# EAGLE design programmer-shield (EAGLE 7.2.0)
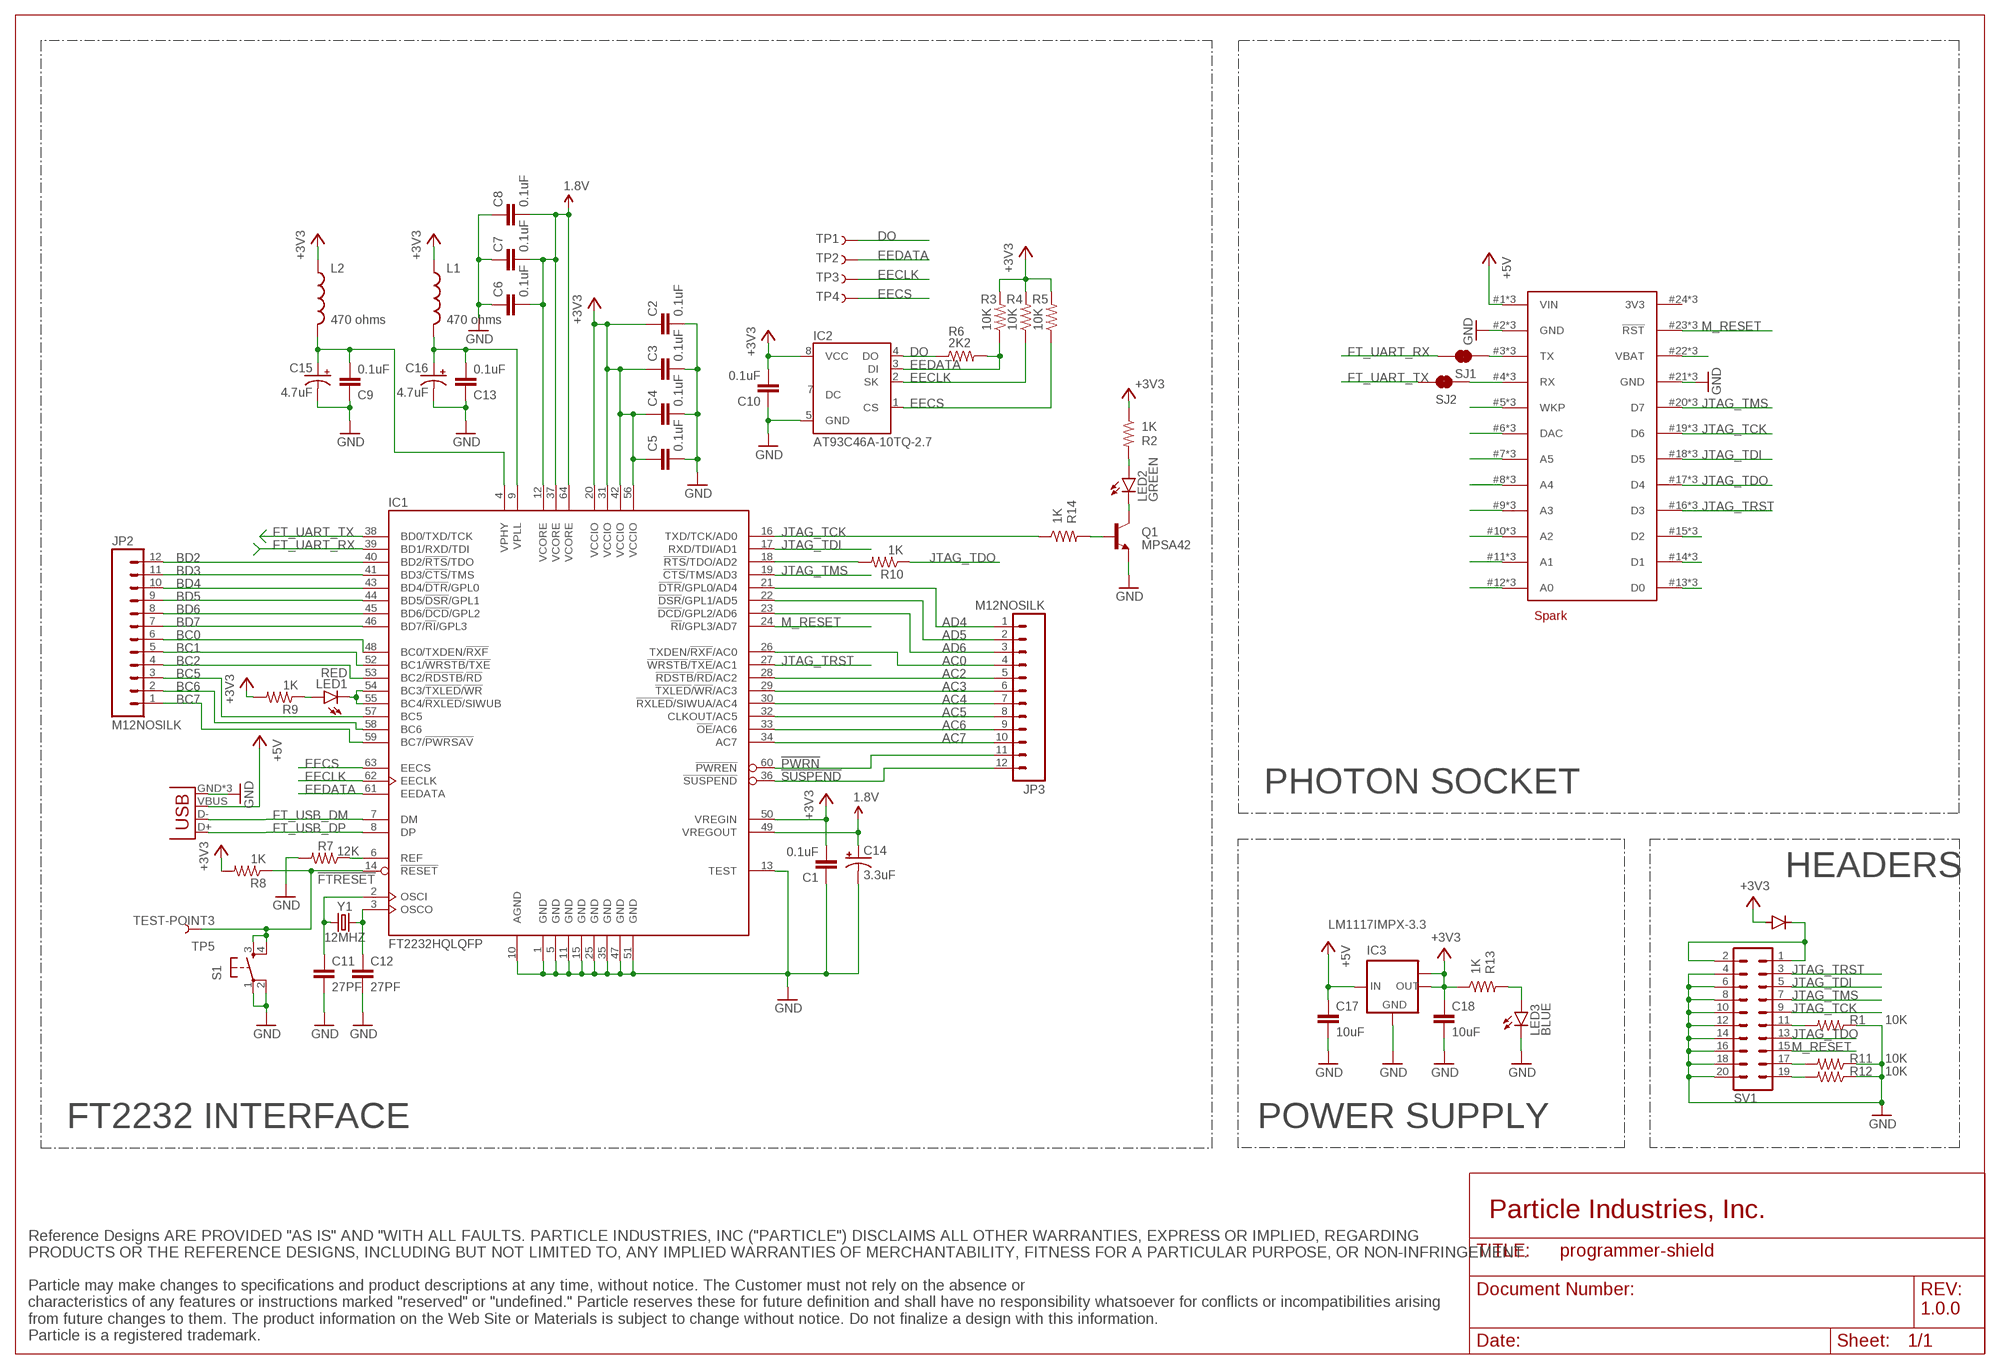
[diagram p0: schematic, sheet 1]

## Parts
C1  0.1uF  0.1UF-25V-5%(0603)  [0603-CAP]
C2  0.1uF  0.1UF-25V-5%(0603)  [0603-CAP]
C3  0.1uF  0.1UF-25V-5%(0603)  [0603-CAP]
C4  0.1uF  0.1UF-25V-5%(0603)  [0603-CAP]
C5  0.1uF  0.1UF-25V-5%(0603)  [0603-CAP]
C6  0.1uF  0.1UF-25V-5%(0603)  [0603-CAP]
C7  0.1uF  0.1UF-25V-5%(0603)  [0603-CAP]
C8  0.1uF  0.1UF-25V-5%(0603)  [0603-CAP]
C9  0.1uF  0.1UF-25V-5%(0603)  [0603-CAP]
C10  0.1uF  0.1UF-25V-5%(0603)  [0603-CAP]
C11  27PF  CAP0603-CAP  [0603-CAP]
C12  27PF  CAP0603-CAP  [0603-CAP]
C13  0.1uF  0.1UF-25V-5%(0603)  [0603-CAP]
C14  3.3uF  CAP_POL1206  [EIA3216]
C15  4.7uF  CAP_POL1206  [EIA3216]
C16  4.7uF  CAP_POL1206  [EIA3216]
C17  10uF  CAP0603-CAP  [0603-CAP]
C18  10uF  CAP0603-CAP  [0603-CAP]
D1  DIODE  [DIODE-DO-220AA(SMP)]
IC1  FT2232HQLQFP  [TQFP64-10X10]
IC2  AT93C46A-10TQ-2.7  [TSSOP8]
IC3  LM1117IMPX-3.3  [SOT223]
JP1  USBUSB-MICROB-SLOT-HOLE  [USB-MICROB-SLOT-HOLE]
JP2  M12NOSILK  [1X12-SMALL-PADS-NO-SILK]
JP3  M12NOSILK  [1X12-SMALL-PADS-NO-SILK]
L1  470 ohms  INDUCTOR0603  [0603]
L2  470 ohms  INDUCTOR0603  [0603]
LED1  RED  LED0603  [LED-0603]
LED2  GREEN  LED0603  [LED-0603]
LED3  BLUE  LED0603  [LED-0603]
Q1  MPSA42  TRANSISTOR_NPNMPSA42  [SOT23]
R1  10K  RESISTOR0603  [0603-RES]
R2  1K  RESISTOR0603  [0603-RES]
R3  10K  RESISTOR0603  [0603-RES]
R4  10K  RESISTOR0603  [0603-RES]
R5  10K  RESISTOR0603  [0603-RES]
R6  2K2  RESISTOR0603  [0603-RES]
R7  12K  RESISTOR0603  [0603-RES]
R8  1K  RESISTOR0603  [0603-RES]
R9  1K  RESISTOR0603  [0603-RES]
R10  1K  RESISTOR0603  [0603-RES]
R11  10K  RESISTOR0603  [0603-RES]
R12  10K  RESISTOR0603  [0603-RES]
R13  1K  RESISTOR0603  [0603-RES]
R14  1K  RESISTOR0603  [0603-RES]
S1  TAC_SWITCHSMD  [TACTILE_SWITCH_SMD]
SJ1  JUMPER-PAD-2-NC_BY_TRACE  [PAD-JUMPER-2-NC_BY_TRACE_YES_SILK]
SJ2  JUMPER-PAD-2-NC_BY_TRACE  [PAD-JUMPER-2-NC_BY_TRACE_YES_SILK]
SV1  ML20  [ML20]
TP1  TEST-POINT3  [PAD.03X.03]
TP2  TEST-POINT3  [PAD.03X.03]
TP3  TEST-POINT3  [PAD.03X.03]
TP4  TEST-POINT3  [PAD.03X.03]
TP5  TEST-POINT3  [PAD.03X.03]
U$1  SPARK_LOGO  [SPARK_LOGO_TSTOP]
U$3  SPARK_CORE  [SPARK_CORE_STACKABLE]
Y1  12MHZ  CRYSTALTXC-7A  [CRYSTAL-TXC-7A]

## Nets
1.8V: C6.2 C7.2 C8.2 C14.A(+) IC1.12(VCORE) IC1.37(VCORE) IC1.49(VREGOUT) IC1.64(VCORE)
!FTRESET: IC1.14(!RESET) R8.1 S1.3 S1.4 TP5.P$1
!PWRN: IC1.60(!PWREN) JP3.11
!SUSPEND: IC1.36(!SUSPEND) JP3.12
+3V3: C1.2 C2.1 C3.1 C4.1 C5.1 C10.2 C18.1 D1.ANODE IC1.20(VCCIO) IC1.31(VCCIO) IC1.42(VCCIO) IC1.50(VREGIN) IC1.56(VCCIO) IC2.8(VCC) IC3.2(OUT) IC3.TAB(OUT1) L1.1 L2.1 R2.1 R3.2 R4.2 R5.2 R8.2 R9.2 R13.1
+5V: C17.1 IC3.3(IN) JP1.VBUS U$3.1(VIN) U$3.#1(VIN) U$3.@1(VIN)
AC0: IC1.26(TXDEN/!RXF!/AC0) JP3.4
AC2: IC1.28(!RDSTB!/!RD!/AC2) JP3.5
AC3: IC1.29(!TXLED!/!WR!/AC3) JP3.6
AC4: IC1.30(!RXLED!/SIWUA/AC4) JP3.7
AC5: IC1.32(CLKOUT/AC5) JP3.8
AC6: IC1.33(!OE!/AC6) JP3.9
AC7: IC1.34(AC7) JP3.10
AD4: IC1.21(!DTR!/GPL0/AD4) JP3.1
AD5: IC1.22(!DSR!/GPL1/AD5) JP3.2
AD6: IC1.23(!DCD!/GPL2/AD6) JP3.3
BC0: IC1.48(BC0/TXDEN/!RXF) JP2.6
BC1: IC1.52(BC1/!WRSTB!/!TXE) JP2.5
BC2: IC1.53(BC2/!RDSTB!/!RD) JP2.4
BC5: IC1.57(BC5) JP2.3
BC6: IC1.58(BC6) JP2.2
BC7: IC1.59(BC7/!PWRSAV) JP2.1
BD2: IC1.40(BD2/!RTS!/TDO) JP2.12
BD3: IC1.41(BD3/!CTS!/TMS) JP2.11
BD4: IC1.43(BD4/!DTR!/GPL0) JP2.10
BD5: IC1.44(BD5/!DSR!/GPL1) JP2.9
BD6: IC1.45(BD6/!DCD!/GPL2) JP2.8
BD7: IC1.46(BD7/!RI!/GPL3) JP2.7
DO: IC2.4(DO) R6.1 TP1.P$1
EECLK: IC1.62(EECLK) IC2.2(SK) R4.1 TP3.P$1
EECS: IC1.63(EECS) IC2.1(CS) R5.1 TP4.P$1
EEDATA: IC1.61(EEDATA) IC2.3(DI) R3.1 R6.2 TP2.P$1
FT_UART_RX: IC1.39(BD1/RXD/TDI) SJ1.2
FT_UART_TX: IC1.38(BD0/TXD/TCK) SJ2.2
FT_USB_DM: IC1.7(DM) JP1.D-
FT_USB_DP: IC1.8(DP) JP1.D+
GND: C1.1 C2.2 C3.2 C4.2 C5.2 C6.1 C7.1 C8.1 C9.1 C10.1 C11.2 C12.2 C13.1 C14.C(-) C15.C(-) C16.C(-) C17.2 C18.2 IC1.1(GND) IC1.5(GND) IC1.10(AGND) IC1.11(GND) IC1.13(TEST) IC1.15(GND) IC1.25(GND) IC1.35(GND) IC1.47(GND) IC1.51(GND) IC2.5(GND) IC3.1(GND) JP1.GND JP1.MT1(GND) JP1.MT2(GND) LED3.C Q1.2(E) R1.1 R7.2 R11.1 R12.1 S1.1 S1.2 SV1.4 SV1.6 SV1.8 SV1.10 SV1.12 SV1.14 SV1.16 SV1.18 SV1.20 U$3.2(GND) U$3.21(GND) U$3.#2(GND) U$3.#21(GND) U$3.@2(GND) U$3.@21(GND)
JTAG_TCK: IC1.16(TXD/TCK/AD0) R14.1 SV1.9 U$3.19(D6) U$3.#19(D6) U$3.@19(D6)
JTAG_TDI: IC1.17(RXD/TDI/AD1) SV1.5 U$3.18(D5) U$3.#18(D5) U$3.@18(D5)
JTAG_TDO: R10.1 SV1.13 U$3.17(D4) U$3.#17(D4) U$3.@17(D4)
JTAG_TMS: IC1.19(!CTS!/TMS/AD3) SV1.7 U$3.20(D7) U$3.#20(D7) U$3.@20(D7)
JTAG_TRST: IC1.27(!WRSTB!/!TXE!/AC1) SV1.3 U$3.16(D3) U$3.#16(D3) U$3.@16(D3)
M_RESET: IC1.24(!RI!/GPL3/AD7) SV1.15 U$3.23(!RST) U$3.#23(!RST) U$3.@23(!RST)
N$1: IC1.6(REF) R7.1
N$2: C13.2 C16.A(+) IC1.9(VPLL) L1.2
N$3: SJ1.1 U$3.3(TX) U$3.#3(TX) U$3.@3(TX)
N$4: C12.1 IC1.3(OSCO) Y1.P$2
N$5: C11.1 IC1.2(OSCI) Y1.P$1
N$6: C9.2 C15.A(+) IC1.4(VPHY) L2.2
N$7: IC1.54(BC3/!TXLED!/!WR) IC1.55(BC4/!RXLED!/SIWUB) LED1.C
N$8: LED1.A R9.1
N$9: Q1.1(B) R14.2
N$10: U$3.22(VBAT) U$3.#22(VBAT) U$3.@22(VBAT)
N$11: U$3.15(D2) U$3.#15(D2) U$3.@15(D2)
N$12: LED3.A R13.2
N$13: U$3.14(D1) U$3.#14(D1) U$3.@14(D1)
N$14: U$3.13(D0) U$3.#13(D0) U$3.@13(D0)
N$15: IC1.18(!RTS!/TDO/AD2) R10.2
N$16: U$3.5(WKP) U$3.#5(WKP) U$3.@5(WKP)
N$17: U$3.6(DAC) U$3.#6(DAC) U$3.@6(DAC)
N$18: U$3.7(A5) U$3.#7(A5) U$3.@7(A5)
N$19: U$3.8(A4) U$3.#8(A4) U$3.@8(A4)
N$20: U$3.9(A3) U$3.#9(A3) U$3.@9(A3)
N$21: U$3.10(A2) U$3.#10(A2) U$3.@10(A2)
N$22: U$3.11(A1) U$3.#11(A1) U$3.@11(A1)
N$23: SJ2.1 U$3.4(RX) U$3.#4(RX) U$3.@4(RX)
N$24: U$3.12(A0) U$3.#12(A0) U$3.@12(A0)
N$25: D1.CATHODE SV1.1 SV1.2
N$44: LED2.C Q1.3(C)
N$45: LED2.A R2.2
N$50: R1.2 SV1.11
N$53: R11.2 SV1.17
N$54: R12.2 SV1.19
Unconnected: IC2.6(NC) IC2.7(DC)

## Notes on the sheet
- PHOTON SOCKET
- HEADERS
- FT2232 INTERFACE | POWER SUPPLY
- Particle Industries, Inc.
- 1.0.0
- Reference Designs ARE PROVIDED "AS IS" AND "WITH ALL FAULTS. PARTICLE INDUSTRIES, INC ("PARTICLE") DISCLAIMS ALL OTHER WARRANTIES, EXPRESS OR IMPLIED, REGARDING 
  PRODUCTS OR THE REFERENCE DESIGNS, INCLUDING BUT NOT LIMITED TO, ANY IMPLIED WARRANTIES OF MERCHANTABILITY, FITNESS FOR A PARTICULAR PURPOSE, OR NON-INFRINGEMENT.
  
  Particle may make changes to specifications and product descriptions at any time, without notice. The Customer must not rely on the absence or 
  characteristics of any features or instructions marked "reserved" or "undefined." Particle reserves these for future definition and shall have no responsibility whatsoever for conflicts or incompatibilities arising 
  from future changes to them. The product information on the Web Site or Materials is subject to change without notice. Do not finalize a design with this information. 
  Particle is a registered trademark.

## Power pins joined to a net without a drawn wire
3V3: U$3.24(3V3) U$3.#24(3V3) U$3.@24(3V3)

## Library data of the parts
C1-C10 C13 = SparkFun-Capacitors:0.1UF-25V-5%(0603): CAP-08604; PROD_ID: CAP-08604
C11 C12 C17 C18 = SparkFun-Capacitors:CAP: Capacitor Standard 0603 ceramic capacitor, and 0.1" leaded capacitor.
C14-C16 = SparkFun-Capacitors:CAP_POL: Capacitor Polarized These are standard SMD and PTH capacitors. Normally 10uF, 47uF, and 100uF in electrolytic and tantalum varieties. Always verify the external diameter of the through hole cap, it varies with capacity, voltage, and manufacturer. The EIA devices should be standard.
D1 = Spark:DIODE
IC1 = jt-ftdi:FT2232HQ: FTDI FT2232 dual RS232
IC2 = atmel:AT93C46A-10?Q-2.7: Three-wire Automotive Temperature Serial EEPROM 1K (64 x 16) Source: http://www.atmel.com/dyn/resources/prod_documents/doc5089.pdf; OC_FARNELL: unknown; OC_NEWARK: unknown
IC3 = lm1117:LM1117IMPX-*
JP1 = Spark:USB
JP2 JP3 = Spark:M12: Header 12 Standard 12-pin 0.1" header. Use with straight break away headers (SKU : PRT-00116), right angle break away headers (PRT-00553), swiss pins (PRT-00743), machine pins (PRT-00117), and female headers (PRT-00115).
L1 L2 = SparkFun-Passives:INDUCTOR: Inductors Basic Inductor/Choke - 0603 and 1206. Footprints are not proven and vary greatly between part numbers. SRN6045- 33uH, 20% 1.4A SDR0403-560KL - 56uH, 10%, 500mA RMS/740mA peak
LED1-LED3 = SparkFun-LED:LED: LEDs Standard schematic elements and footprints for 5mm, 3mm, 1206, and 0603 sized LEDs. 5mm - Spark Fun Electronics SKU : COM-00529 (and others)
Q1 = SparkFun-DiscreteSemi:TRANSISTOR_NPN: Generic NPN BJT MMBT2222A - TRANS-08049 (SOT-23, 1A 40V) MPSA42 - TRANS-09116 (SOT-23, 500mA 300V) MMBT5088LT1G - TRANS-11160 (SOT-23, 50 mA 30V) BC547 - COM-08928 <http://www.sparkfun.com/products/8928> (TO-92 45V 100mA) (1.Collector 2.Base 3.Emitter) 2N3904 - COM-00521 <http://www.sparkfun.com/products/521> (TO-92 40V 200mA) (1.Emitter 2.Base 3.Collector) P2N2222A - COM-12852 <http://www.sparkfun.com/products/12852> (TO-92 40V 600mA) (1.Collector 2.Base 3.Emitter); PROD_ID: TRANS-09116
R1-R14 = SparkFun-Resistors:RESISTOR: Resistor Basic schematic elements and footprints for 0603, 1206, and PTH resistors.
S1 = Spark:TAC_SWITCH: SMD Tactiile Switch
SJ1 SJ2 = SparkFun-Passives:JUMPER-PAD-2-NC_BY_TRACE
SV1 = Spark:ML20: HARTING; OC_FARNELL: unknown; OC_NEWARK: unknown
TP1-TP5 = SparkFun-Passives:TEST-POINT: Bare copper test points for troubleshooting or ICT
U$1 = Spark:SPARK_LOGO
U$3 = Spark:SPARK_CORE
Y1 = SparkFun-FreqCtrl:CRYSTAL: Various standard crystals. Proven footprints. Spark Fun Electronics SKU : COM-00534

## Board
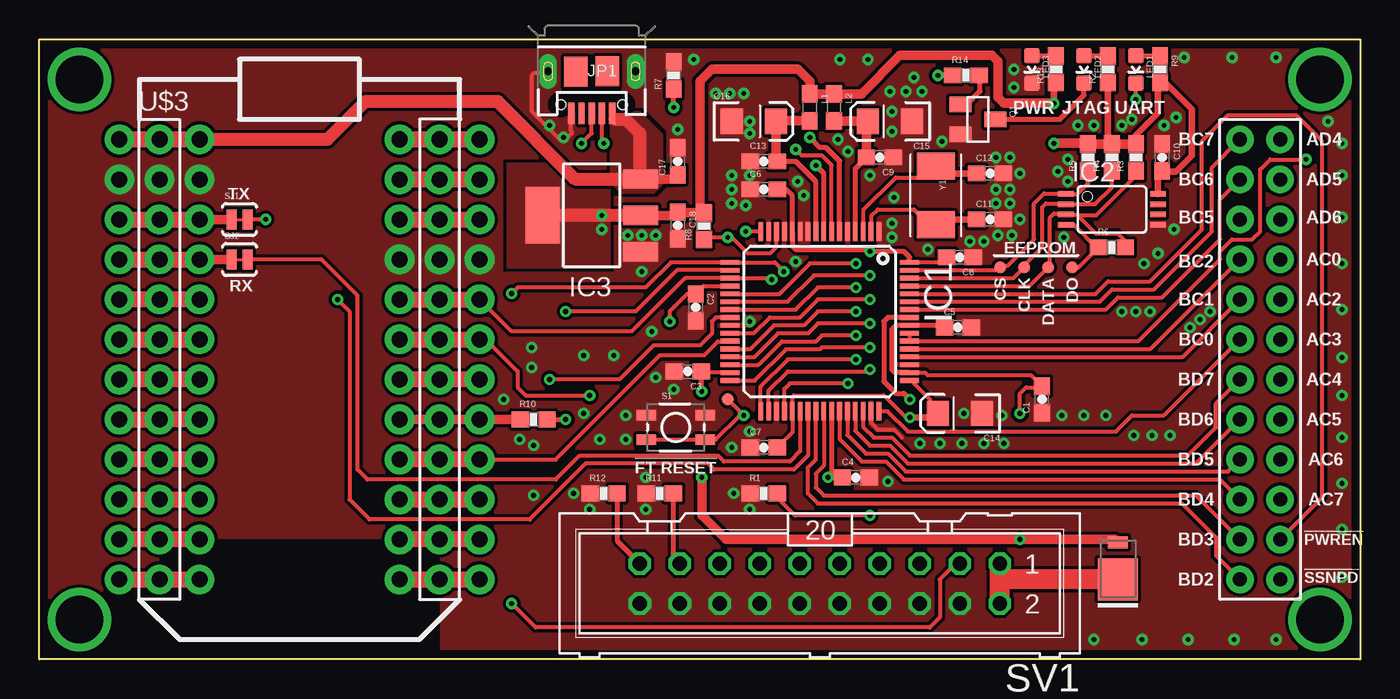
[diagram p1: board, top side]
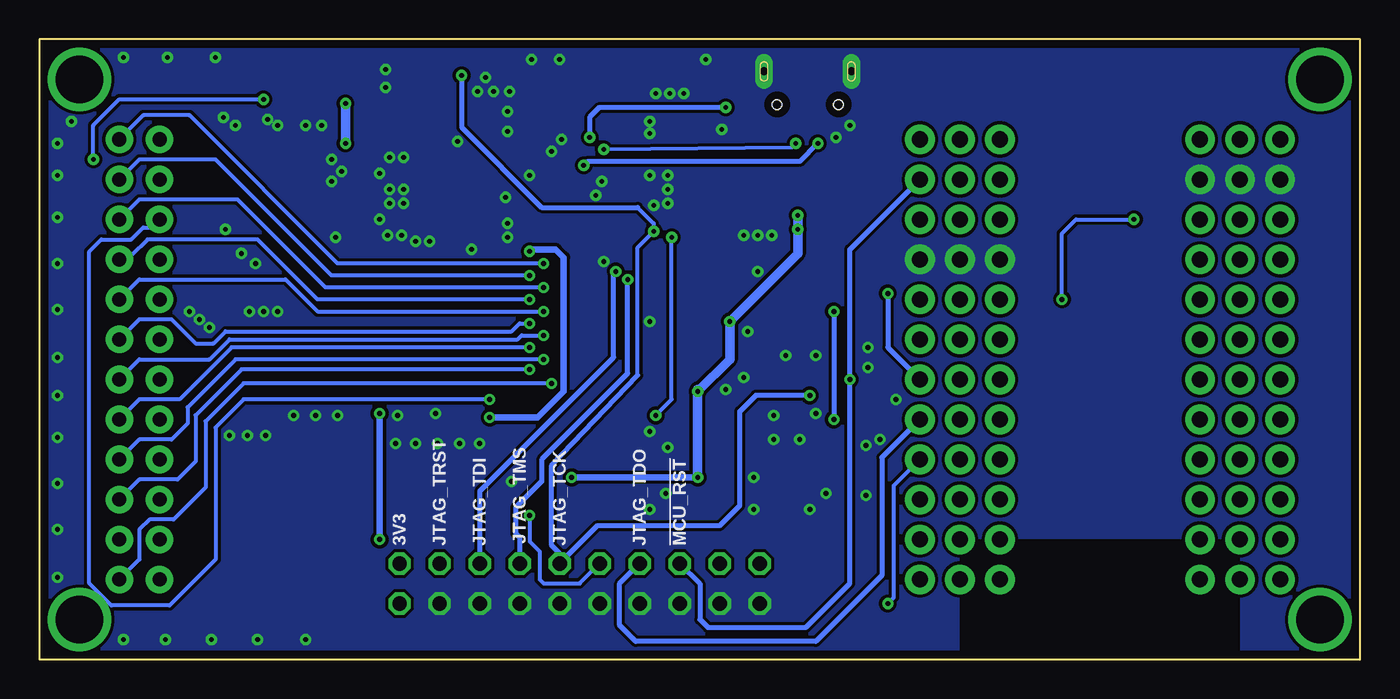
[diagram p2: board, bottom side, seen from below]

Size 83.82 x 39.37 mm. Coordinates in mm from the lower left corner, seen from the top.
Outline: 0,39.37 83.82,39.37 83.82,0 0,0 0,39.37
Copper layers (1*16): Top 0.035mm / dielectric 1.5mm / Bottom 0.035mm
Design rules "default *": minimum track width 10mil, minimum drill 24mil, track to track 8mil, track to pad 8mil, pad to pad 8mil, via to via 8mil, smd to smd 8mil, copper to edge 20mil, drill to drill 8mil, minimum pad ring 10mil, minimum via ring 8mil, stop-mask expansion 4mil, vias tented up to drill 12mil, thermal gap 10mil
tRestrict: area 7.6,0 to 25.4,7.6
bRestrict: area 7.6,0 to 25.4,7.6

### Footprints (pad centres in the part's own frame; a part is rotated, then mirrored left to right if it is on the bottom)
0603-CAP = smd 1.1 x 1: 1 -0.85,0; 2 0.85,0
EIA3216 = smd 1.4 x 1.6: A 1.4,0; C -1.4,0
DIODE-DO-220AA(SMP) = smd 0.762 x 1.27: ANODE 2.349,0 | smd 2.667 x 2.54: CATHODE 0,0
TQFP64-10X10 = smd 1.2 x 0.3: 1 -5.7,3.75; 2 -5.7,3.25; 3 -5.7,2.75; 4 -5.7,2.25; 5 -5.7,1.75; 6 -5.7,1.25; 7 -5.7,0.75; 8 -5.7,0.25; 9 -5.7,-0.25; 10 -5.7,-0.75; 11 -5.7,-1.25; 12 -5.7,-1.75; 13 -5.7,-2.25; 14 -5.7,-2.75; 15 -5.7,-3.25; 16 -5.7,-3.75; 33 5.7,-3.75; 34 5.7,-3.25; 35 5.7,-2.75; 36 5.7,-2.25; 37 5.7,-1.75; 38 5.7,-1.25; 39 5.7,-0.75; 40 5.7,-0.25; 41 5.7,0.25; 42 5.7,0.75; 43 5.7,1.25; 44 5.7,1.75; 45 5.7,2.25; 46 5.7,2.75; 47 5.7,3.25; 48 5.7,3.75 | smd 0.3 x 1.2: 17 -3.75,-5.7; 18 -3.25,-5.7; 19 -2.75,-5.7; 20 -2.25,-5.7; 21 -1.75,-5.7; 22 -1.25,-5.7; 23 -0.75,-5.7; 24 -0.25,-5.7; 25 0.25,-5.7; 26 0.75,-5.7; 27 1.25,-5.7; 28 1.75,-5.7; 29 2.25,-5.7; 30 2.75,-5.7; 31 3.25,-5.7; 32 3.75,-5.7; 49 3.75,5.7; 50 3.25,5.7; 51 2.75,5.7; 52 2.25,5.7; 53 1.75,5.7; 54 1.25,5.7; 55 0.75,5.7; 56 0.25,5.7; 57 -0.25,5.7; 58 -0.75,5.7; 59 -1.25,5.7; 60 -1.75,5.7; 61 -2.25,5.7; 62 -2.75,5.7; 63 -3.25,5.7; 64 -3.75,5.7
TSSOP8 = smd 0.35 x 1: 1 -0.975,-2.925; 2 -0.325,-2.925; 3 0.325,-2.925; 4 0.975,-2.925; 5 0.975,2.925; 6 0.325,2.925; 7 -0.325,2.925; 8 -0.975,2.925
SOT223 = smd 1.219 x 2.235: 1 -2.311,-3.099; 2 0,-3.099; 3 2.311,-3.099 | smd 3.6 x 2.2: TAB 0,3.099
USB-MICROB-SLOT-HOLE = smd 0.4 x 1.35: D+ 0,2.675; D- -0.65,2.675; GND 1.3,2.675; ID 0.65,2.675; VBUS -1.3,2.675 | drill 0.5 pad 1.1 long: MT1 -2.775,0; MT2 2.775,0 | smd 1.5 x 1.9: P$1 -1,0; P$2 1,0.01 | hole 0.6: -1.95,2.1; 1.95,2.1
1X12-SMALL-PADS-NO-SILK = drill 0.889 pad 1.753: 1 -13.97,0; 2 -11.43,0; 3 -8.89,0; 4 -6.35,0; 5 -3.81,0; 6 -1.27,0; 7 1.27,0; 8 3.81,0; 9 6.35,0; 10 8.89,0; 11 11.43,0; 12 13.97,0
0603 = smd 1.1 x 1: 1 -0.85,0; 2 0.85,0
LED-0603 = smd 1 x 1: A 0,-0.877; C 0,0.877
SOT23 = smd 1 x 1.4: 1 -0.95,-1.1; 2 0.95,-1.1; 3 0,1.1
0603-RES = smd 1.1 x 1: 1 -0.85,0; 2 0.85,0
TACTILE_SWITCH_SMD = smd 1.25 x 0.65: 1 -1.875,0.775; 2 1.875,0.775; 3 -1.875,-0.775; 4 1.875,-0.775
PAD-JUMPER-2-NC_BY_TRACE_YES_SILK = smd 0.635 x 1.27: 1 -0.508,0; 2 0.508,0
ML20 = drill 0.914 octagon: 1 -11.43,-1.27; 2 -11.43,1.27; 3 -8.89,-1.27; 4 -8.89,1.27; 5 -6.35,-1.27; 6 -6.35,1.27; 7 -3.81,-1.27; 8 -3.81,1.27; 9 -1.27,-1.27; 10 -1.27,1.27; 11 1.27,-1.27; 12 1.27,1.27; 13 3.81,-1.27; 14 3.81,1.27; 15 6.35,-1.27; 16 6.35,1.27; 17 8.89,-1.27; 18 8.89,1.27; 19 11.43,-1.27; 20 11.43,1.27
PAD.03X.03 = smd 0.762 x 0.762: P$1 0,0
SPARK_CORE_STACKABLE = drill 1.016 pad 1.88: 1 -8.89,13.97; 2 -8.89,11.43; 3 -8.89,8.89; 4 -8.89,6.35; 5 -8.89,3.81; 6 -8.89,1.27; 7 -8.89,-1.27; 8 -8.89,-3.81; 9 -8.89,-6.35; 10 -8.89,-8.89; 11 -8.89,-11.43; 12 -8.89,-13.97; 13 8.89,-13.97; 14 8.89,-11.43; 15 8.89,-8.89; 16 8.89,-6.35; 17 8.89,-3.81; 18 8.89,-1.27; 19 8.89,1.27; 20 8.89,3.81; 21 8.89,6.35; 22 8.89,8.89; 23 8.89,11.43; 24 8.89,13.97; #1 -6.35,13.97; #2 -6.35,11.43; #3 -6.35,8.89; #4 -6.35,6.35; #5 -6.35,3.81; #6 -6.35,1.27; #7 -6.35,-1.27; #8 -6.35,-3.81; #9 -6.35,-6.35; #10 -6.35,-8.89; #11 -6.35,-11.43; #12 -6.35,-13.97; #13 11.43,-13.97; #14 11.43,-11.43; #15 11.43,-8.89; #16 11.43,-6.35; #17 11.43,-3.81; #18 11.43,-1.27; #19 11.43,1.27; #20 11.43,3.81; #21 11.43,6.35; #22 11.43,8.89; #23 11.43,11.43; #24 11.43,13.97; @1 -11.43,13.97; @2 -11.43,11.43; @3 -11.43,8.89; @4 -11.43,6.35; @5 -11.43,3.81; @6 -11.43,1.27; @7 -11.43,-1.27; @8 -11.43,-3.81; @9 -11.43,-6.35; @10 -11.43,-8.89; @11 -11.43,-11.43; @12 -11.43,-13.97; @13 6.35,-13.97; @14 6.35,-11.43; @15 6.35,-8.89; @16 6.35,-6.35; @17 6.35,-3.81; @18 6.35,-1.27; @19 6.35,1.27; @20 6.35,3.81; @21 6.35,6.35; @22 6.35,8.89; @23 6.35,11.43; @24 6.35,13.97
CRYSTAL-TXC-7A = smd 1.7 x 2.4: P$1 1.85,0; P$2 -1.85,0

### Placement (x,y rotation side)
C1  63.63,16.51 90 top
C2  41.66,22.35 270 top
C3  41.15,18.29 180 top
C4  51.82,11.56 0 top
C5  58.29,21.08 0 top
C6  45.97,29.84 0 top
C7  45.97,13.46 0 top
C8  58.42,25.53 180 top
C9  53.34,31.88 180 top
C10  71.25,31.88 270 top
C11  60.33,27.94 0 top
C12  60.33,30.86 0 top
C13  45.97,31.62 0 top
C14  58.42,15.62 180 top
C15  53.98,34.16 180 top
C16  45.34,34.16 0 top
C17  40.51,31.62 90 top
C18  40.51,27.56 270 top
D1  68.45,5.08 90 top
IC1  49.53,21.46 270 top
IC2  68.07,28.57 270 top
IC3  35.05,28.19 90 top
JP1  35.05,37.34 180 top
JP2  76.2,19.05 270 top
JP3  78.74,19.05 270 top
L1  48.9,35.05 270 top
L2  50.42,35.05 270 top
LED1  69.6,37.47 180 top
LED2  66.29,37.47 180 top
LED3  62.99,37.47 180 top
Q1  59.56,34.29 270 top
R1  45.97,10.54 0 top
R2  67.82,37.47 90 top
R3  69.6,31.88 90 top
R4  68.07,31.88 90 top
R5  66.55,31.88 90 top
R6  68.07,26.16 0 top
R7  40.26,37.08 90 top
R8  42.17,27.51 90 top
R9  71.12,37.47 270 top
R10  31.37,15.24 0 top
R11  39.37,10.54 0 top
R12  35.81,10.54 0 top
R13  64.52,37.47 90 top
R14  58.8,37.08 0 top
S1  40.39,14.73 0 top
SJ1  12.7,27.94 0 top
SJ2  12.7,25.4 0 top
SV1  49.53,4.83 180 top
TP1  65.53,24.89 0 top
TP2  64.01,24.89 0 top
TP3  62.48,24.89 0 top
TP4  60.96,24.89 0 top
TP5  43.69,16.51 0 top
U$1  16.51,19.05 270 top
U$2  [SPARK_LOGO2]  1.14,11.05 0 top
U$3  16.51,19.05 0 top
Y1  56.9,29.46 270 top

### Tracks (layer width: path | path; a pad name or v marks a point on that pad's centre or on a via)
1.8V  (via drill 0.3, 0.3 pad 0.71)
  Top 0.254: C8.2 57.64,25.21 IC1.64 | 55.18,17.71 IC1.49 55.31,17.71 56.52,16.51 56.52,16.13 C14.A | C7.2 47.78,14.42 IC1.37 47.78,16.66 47.88,16.76 53.59,16.76 54.99,15.37 v55.24,15.37
  Top 0.305: C6.2 47.37,29.84 47.78,29.44 IC1.12 47.78,26.26 48.01,26.04 52.58,26.04 v52.7,25.91 54.86,25.91 55.23,25.54 IC1.64
  Top 0.406: v55.24,15.37 56.51,15.37 | 56.51,15.37 | 56.51,15.37 56.77,15.37 C14.A
  Bottom 0.406: v55.24,15.37 52.2,15.37 50.55,17.02 50.55,25.53 51.05,26.04 52.58,26.04 v52.7,25.91
3V3
  Top 1.016: U$3.@24 U$3.24 U$3.#24
!FTRESET  (via drill 0.3)
  Top 0.254: IC1.14 46.74,27.12 46.74,26.16 46.35,25.78 44.96,25.78 43.94,26.8 v43.69,26.8 42.31,26.8 R8.1 | S1.3 S1.4 42.91,13.96 44.45,15.49 | 44.45,15.49 v44.7,15.49 | 44.45,15.49 44.45,15.75 TP5.P$1
  Bottom 0.254: v44.7,15.49 TP5.P$1 v43.69,26.8
!PWRN
  Top 0.254: JP3.11 81.41,10.29 81.41,32.89 79.76,34.54 75.44,34.54 73.79,32.89 73.79,27.3 70.48,24 67.82,24 67.03,23.21 IC1.60
!SUSPEND  (via drill 0.3 pad 0.71)
  Top 0.254: IC1.36 47.28,17.18 47.62,17.53 v51.31,17.53
  Bottom 0.254: JP3.12 77.47,6.35 77.47,8.26 76.83,8.89 75.31,8.89 73.28,10.92 73.28,15.11 70.87,17.53 v51.31,17.53
+3V3  (via drill 0.3, 0.3 pad 0.71)
  Top 0.254: IC1.31 42.07,18.21 | IC1.20 42.17,23.71 C2.1 41.11,23.2 40.01,22.1 v40.01,21.46 | v62.23,15.62 62.23,16.89 62.61,17.27 63.54,17.27 C1.2 62.95,18.03 56.39,18.03 56.21,18.21 IC1.50
  Top 0.305: 42.07,18.21 C3.1 42,17.06 v42.04,17.02 | 50.29,15.78 IC1.42 50.28,11.8 v50.04,11.56 | IC1.50 54.3,18.21 54.1,18.41 54.1,20.95 54.36,21.21 IC1.56 57.31,21.21 C5.1
  Top 0.406: v50.04,11.56 C4.1 | R2.1 67.82,32.98 R4.2 | v64.39,35.31 64.39,36.49 R13.1 | 63.59,17.4 C1.2 | R3.2 69.6,33.27 70.99,34.67 70.99,36.49 R9.2 71.46,36.62 73.15,34.92 73.15,32 72.14,30.99 71.29,30.99 | 71.29,30.99 C10.2 | 71.29,30.99 71,30.7 IC2.8
  Top 0.61: IC3.2 40.3,28.19 C18.1 40.56,28.36 R8.2 41.91,28.63 41.91,36.7 42.67,37.47 48.13,37.47 48.9,36.7 L1.1 L2.1 52.16,35.9 54.61,38.35 60.45,38.35 60.83,37.97 60.83,35.69 61.21,35.31 v64.39,35.31 | v42.04,11.56 42.04,9.14 43.56,7.62 v62.23,7.62 68.26,7.62 D1.ANODE | R3.2 R4.2 R5.2 66.51,32.77 v64.39,32.77
  Top 0.813: IC3.2 v35.69,28.19 IC3.TAB
  Bottom 0.406: v62.23,15.62 v62.23,7.62 | v42.04,11.56 v50.04,11.56
  Bottom 0.61: v42.04,17.02 40.01,19.05 v40.01,21.46 35.69,25.78 v35.69,28.19 v35.69,27.3 | v42.04,11.56 v42.04,17.02 | v42.04,17.02 42.04,17.14 | v64.39,35.31 v64.39,32.77
  pour Top (no thermals): 36.2,24.89 29.72,24.89 29.72,31.5 36.2,31.5
+5V
  Top 0.203: JP1.VBUS 36.35,34.32 36.32,34.29
  Top 0.406: 36.32,34.29 36.58,34.29
  Top 0.61: IC3.3 40.24,30.5 C17.1
  Top 0.813: 36.58,34.29 37.21,34.29 38.1,33.4 38.1,30.56 IC3.3 34.01,30.5 29.08,35.43 20.7,35.43 18.29,33.02 U$3.#1
  Top 1.016: U$3.@1 U$3.1 U$3.#1
  pour Top (no thermals): 36.32,34.67 36.32,30.35 36.96,29.72 38.99,29.72 39.5,30.23 39.5,33.27 38.1,34.67
AC0  (via drill 0.3 pad 0.71)
  Top 0.254: IC1.26 45.35,20.71 46.35,21.72 48.26,21.72 49.4,22.86 v52.7,22.86
  Bottom 0.254: v52.7,22.86 66.17,22.86 69.98,26.67 76.96,26.67 77.98,25.65 78.49,25.65 JP3.4
AC2  (via drill 0.3 pad 0.71)
  Top 0.254: IC1.28 43.86,19.68 45.09,19.68 46.61,21.21 48.51,21.21 49.4,22.1 v51.82,22.1
  Bottom 0.254: JP3.5 77.47,24.13 68.2,24.13 66.17,22.1 v51.82,22.1
AC3  (via drill 0.3 pad 0.71)
  Top 0.254: IC1.29 43.87,19.18 45.34,19.18 46.86,20.7 48.77,20.7 49.4,21.34 v52.7,21.34
  Bottom 0.254: JP3.6 77.47,21.59 75.44,21.59 73.91,20.07 72.77,20.07 72.01,20.83 53.85,20.83 53.34,21.34 v52.7,21.34
AC4  (via drill 0.3 pad 0.71)
  Top 0.254: IC1.30 45.64,18.71 47.12,20.19 49.28,20.19 49.66,20.57 v51.82,20.57
  Bottom 0.254: JP3.7 77.47,19.05 73.03,19.05 71.75,20.32 53.47,20.32 53.21,20.57 v51.82,20.57
AC5  (via drill 0.3 pad 0.71)
  Top 0.254: IC1.32 45.4,17.71 47.37,19.68 49.53,19.68 49.66,19.81 v52.7,19.81
  Bottom 0.254: JP3.8 77.47,16.51 74.93,16.51 71.63,19.81 v52.7,19.81
AC6  (via drill 0.3 pad 0.71)
  Top 0.254: IC1.33 45.78,17.33 47.5,19.05 v51.82,19.05
  Bottom 0.254: v51.82,19.05 71.37,19.05 74.42,16 74.42,14.99 75.44,13.97 77.47,13.97 JP3.9
AC7  (via drill 0.3 pad 0.71)
  Top 0.254: IC1.34 46.28,17.07 47.5,18.29 52.58,18.29 v52.7,18.41
  Bottom 0.254: v52.7,18.41 70.99,18.41 73.91,15.49 73.91,12.57 75.06,11.43 77.47,11.43 JP3.10
AD4  (via drill 0.3 pad 0.71)
  Top 0.254: IC1.21 46.96,23.21 48.9,25.15 v51.82,25.15
  Bottom 0.254: JP3.1 77.22,34.54 74.3,34.54 64.9,25.15 v51.82,25.15
AD5  (via drill 0.3 pad 0.71)
  Top 0.254: IC1.22 47.48,22.71 49.15,24.38 v52.7,24.38
  Bottom 0.254: JP3.2 77.47,31.75 72.64,31.75 65.28,24.38 v52.7,24.38
AD6  (via drill 0.3 pad 0.71)
  Top 0.254: IC1.23 47.99,22.21 49.4,23.62 v51.82,23.62
  Bottom 0.254: JP3.3 77.47,29.21 71.25,29.21 65.66,23.62 v51.82,23.62
BC0
  Top 0.254: JP2.6 71.37,15.49 69.34,15.49 68.33,14.48 55.12,14.48 53.83,15.76 IC1.48
BC1
  Top 0.254: IC1.52 72.55,19.21 JP2.5
BC2
  Top 0.254: IC1.53 70.51,19.71 JP2.4
BC5  (via drill 0.3 pad 0.71)
  Top 0.305: IC1.57 53.84,21.71 53.59,21.46 53.59,17.65 54.36,16.89 54.86,16.89 v55.24,16.51
  Bottom 0.254: v55.24,16.51 70.87,16.51 72.64,14.73 72.64,6.35 75.56,3.43 79.25,3.43 80.64,4.83 80.64,25.91 79.88,26.67 77.98,26.67 77.22,27.43 76.71,27.43 JP2.3
BC6
  Top 0.254: JP2.2 74.93,29.21 74.93,26.67 71.25,22.99 68.45,22.99 67.69,22.23 62.61,22.23 62.6,22.21 IC1.58
BC7
  Top 0.254: JP2.1 74.42,31.24 74.42,27.18 70.74,23.5 68.07,23.5 67.29,22.71 IC1.59
BD2
  Top 0.254: JP2.12 74.68,6.6 74.68,7.75 72.52,9.91 49.4,9.91 48.77,10.54 48.77,12.19 49.28,12.7 IC1.40
BD3
  Top 0.254: JP2.11 73.41,10.41 49.78,10.41 49.28,10.92 49.28,11.81 49.78,12.31 IC1.41
BD4
  Top 0.254: IC1.43 50.78,13.99 52.2,12.57 53.72,12.57 54.86,11.43 74.93,11.43 JP2.10
BD5
  Top 0.254: JP2.9 75.44,11.94 54.99,11.94 53.85,13.08 52.45,13.08 51.28,14.25 IC1.44
BD6
  Top 0.254: IC1.45 51.78,14.51 52.7,13.59 53.98,13.59 55.12,12.45 73.41,12.45 JP2.8
BD7
  Top 0.254: IC1.46 52.28,14.78 52.96,14.1 54.1,14.1 55.24,12.95 72.9,12.95 74.68,14.73 74.68,16.26 JP2.7
DO
  Top 0.254: IC2.4 65.66,27.6 67.09,26.16 R6.1 | 67.09,26.04 R6.1 | TP1.P$1 65.95,24.89 R6.1
EECLK
  Top 0.254: R4.1 68.07,29.97 67,28.9 IC2.2 65.09,28.96 63.88,28.96 63.63,28.7 63.63,26.16 62.48,25.02 TP3.P$1 61.8,24.21 IC1.62
EECS
  Top 0.254: R5.1 66.55,30.23 65.87,29.55 IC2.1 65.11,29.59 63.75,29.59 63.12,28.96 63.12,26.67 61.47,25.02 60.96,25.02 TP4.P$1 60.65,24.71 IC1.63
EEDATA
  Top 0.254: R6.2 68.96,26.07 68.96,26.54 68.45,27.05 67.06,27.05 65.91,28.19 | 65.91,28.19 65.86,28.25 IC2.3 65.08,28.32 64.39,28.32 64.14,28.07 64.14,25.15 TP2.P$1 62.83,23.71 IC1.61 | R3.1 69.6,30.73 67.06,28.19 65.91,28.19
FT_UART_RX  (via drill 0.3)
  Top 0.254: IC1.39 48.78,12.97 47.88,12.06 42.8,12.06 42.42,12.45 34.67,12.45 31.11,8.89 20.95,8.89 19.68,10.16 19.68,22.1 v18.92,22.86 | v14.35,27.94 SJ1.2
  Bottom 0.254: v18.92,22.86 18.92,27.05 18.03,27.94 v14.35,27.94
FT_UART_TX
  Top 0.254: IC1.38 48.28,13.23 47.62,12.57 43.43,12.57 43.05,12.95 34.29,12.95 32.77,11.43 20.83,11.43 20.19,12.06 20.19,23.11 17.91,25.4 SJ2.2
FT_USB_DM  (via drill 0.3)
  Top 0.254: v35.81,32.77 35.7,32.88 JP1.D- | IC1.7 50.28,31.38 49.66,32 48.39,32 v48.01,32.38
  Bottom 0.254: v35.81,32.77 36.07,32.51 v48.01,32.38
FT_USB_DP  (via drill 0.3)
  Top 0.254: IC1.8 | v34.42,32.77 35.05,33.4 JP1.D+
  Top 0.305: IC1.8 49.78,30.86 v49.28,31.37
  Bottom 0.305: v34.42,32.77 35.56,31.62 49.02,31.62 v49.28,31.37
GND  (via drill 0.3, 0.3 pad 0.71)
  Top 0.254: JP1.MT2 32.15,37.21 31.37,37.21 31.24,37.08 31.24,34.8 33.02,33.02 33.4,33.02 33.78,33.4 33.78,33.53 33.75,33.56 JP1.GND | IC1.47 52.78,15.04 53.21,14.61 54.23,14.61 54.74,14.1
  other vias: 64.64,30.99 71.37,33.91 70.48,22.1 68.71,33.91 75.69,38.23 82.68,32.77 60.71,28.96 61.59,28.96 62.23,30.86 60.71,29.84 61.59,31.88 60.83,26.92 57.28,32.89 56.01,36.07 54.23,29.34 43.94,29.84 40.51,33.66 38.23,24.64 40.26,17.14 34.92,9.53 38.48,9.53 67.69,15.49 52.58,38.1 41.53,38.1 66.93,33.91 70.1,25.15 43.81,35.94 43.94,28.96 43.94,30.73 54.1,27.69 66.93,1.27 64.9,15.49 72.9,1.27 78.49,1.27 72.14,34.42 61.85,37.47 81.79,34.16 50.8,38.1 31.37,10.41 66.29,15.49 78.49,38.23 75.82,1.27 69.6,22.1 69.98,1.27 68.71,22.1 54.99,36.07 52.7,30.73 38.86,20.83 39.12,17.91 61.85,36.32 72.64,38.23 45.09,21.46 48.51,29.46 51.31,32.26 50.67,33.02 42.93,35.94 44.7,35.94 53.98,36.07 55.5,36.96 59.94,26.54 59.05,26.54 65.28,31.75 65.28,30.35 65.91,33.91 69.34,34.29 69.47,14.22 71.75,14.22 70.61,14.22 53.85,11.3 44.07,10.54 45.09,9.53 38.48,11.56 33.91,10.54 34.54,19.3 36.45,19.3 31.24,19.81 31.24,18.54 32.38,33.91 33.27,33.15 45.09,14.48 43.94,13.46 65.02,26.8 82.68,5.21 82.68,11.18 82.68,16.76 82.68,14.1 82.68,8.26 82.68,19.18 82.68,25.15 82.68,30.73 82.68,28.07 82.68,22.23 37.21,13.97 37.21,15.49 31.37,13.59 30.48,13.97 34.54,15.62 29.46,16.51 72.01,27.3 70.99,25.78 74.3,22.1 73.03,21.08 73.66,21.59 35.56,13.97 54.1,26.8 56.39,26.04 61.59,29.84 60.71,31.88 61.72,26.92 62.23,27.94 55.88,13.72 57.15,13.72 58.55,13.72 59.94,13.72 61.21,13.72 48.01,25.27 37.34,26.92 38.23,26.92 39.12,26.92 58.67,15.62 61.09,15.49 45.09,33.4 45.09,34.16 54.1,33.53 54.1,34.8 45.09,30.73 44.83,28.83 48.13,30.35
  pour Top (rank 2, no thermals): 0,39.37 83.82,39.37 83.82,0 0,0
  pour Bottom (rank 2, no thermals): 0,39.37 83.82,39.37 83.82,0 0,0
JTAG_TCK  (via drill 0.3)
  Top 0.254: U$3.#19 28.32,20.32 30.35,18.29 30.35,17.27 30.86,16.76 v34.92,16.76 | IC1.16 arc90 45.77,27.18 v44.83,27.18
  Top 0.305: R14.1 v57.02,37.08
  Top 1.016: U$3.@19 U$3.19 U$3.#19
  Bottom 0.254: 45.85,18.03 45.85,26.16 v44.83,27.18 44.83,27.69 45.85,28.7
  Bottom 0.305: 44.96,27.05 v44.83,27.18 | v34.92,16.76 38.35,16.76 39.37,15.75 39.37,9.78 40.64,8.51 48.39,8.51 SV1.9 50.8,6.73 51.31,7.24 51.31,12.32 45.85,18.03 | v57.02,37.08 57.02,33.78 51.94,28.7 45.85,28.7
JTAG_TDI  (via drill 0.3)
  Top 0.254: v47.24,24.64 46.67,25.21 IC1.17 40.07,25.21 38.48,23.62 30.35,23.62 v29.97,23.24
  Top 1.016: U$3.#18 U$3.18 U$3.@18
  Bottom 0.305: v29.97,23.24 29.97,19.81 U$3.#18 | 55.75,6.1 SV1.5 55.88,10.67 47.37,19.18 47.37,24.51 v47.24,24.64
JTAG_TDO
  Top 0.61: R10.1 U$3.#17 U$3.17 U$3.@17
  Bottom 0.305: U$3.#17 30.35,12.83 30.35,5.33 34.54,1.14 45.97,1.14 46.99,2.16 46.99,4.83 SV1.13
JTAG_TMS  (via drill 0.3)
  Top 0.254: U$3.#20 29.97,20.83 37.59,20.83 40.98,24.21 IC1.19 46.4,24.21
  Top 0.305: 46.4,24.21 v46.48,24.13
  Top 1.016: U$3.@20 U$3.20 U$3.#20
  Bottom 0.305: v46.48,24.13 46.48,18.16 51.94,12.7 51.94,11.3 53.59,9.65 53.59,8 53.34,7.75 SV1.7 53.34,6.35
JTAG_TRST  (via drill 0.3 pad 0.71)
  Top 0.254: U$3.#16 32.77,12.7 39.37,19.3 42.16,19.3 43.05,20.19 43.81,20.19 IC1.27 | SV1.3 58.17,6.1 57.15,5.08 57.15,2.67 56.52,2.03 31.5,2.03 v29.97,3.56
  Top 1.016: U$3.#16 U$3.16 U$3.@16
  Bottom 0.254: v29.97,3.56 29.59,3.94 29.59,11.05 U$3.#16
M_RESET  (via drill 0.3)
  Top 0.254: IC1.24 42.93,21.72 42.67,21.46 42.67,20.7 41.91,19.94 38.99,19.94 36.83,17.78 v32.38,17.78
  Top 1.016: U$3.#23 U$3.23 U$3.@23
  Bottom 0.305: U$3.#23 32.38,26.04 v32.38,17.78 32.38,4.83 35.18,2.03 41.4,2.03 41.91,2.54 41.91,4.83 SV1.15
N$1  (via drill 0.3)
  Top 0.305: v40.26,35.05 R7.1 | IC1.6 50.78,31.64 49.91,32.51 49.53,32.51 v48.9,33.15
  Bottom 0.305: v40.26,35.05 48.26,35.05 48.9,34.42 v48.9,33.15
N$2
  Top 0.305: IC1.9 49.28,30.35 48.01,31.62 C13.2
  Top 0.61: L1.2 46.78,34.2 C16.A 46.74,31.71 C13.2
N$3
  Top 0.61: U$3.#3 SJ1.1
  Top 1.016: U$3.@3 U$3.3 U$3.#3
N$4
  Top 0.254: IC1.3 52.28,28.53 54.36,30.61 56.26,30.61 56.9,31.24 Y1.P$2 56.97,30.86
  Top 0.406: C12.1 56.9,30.86 Y1.P$2
N$5
  Top 0.254: Y1.P$1 56.59,27.23 | IC1.2 52.78,28.14 53.21,28.57 55.5,28.57 56.46,27.61 Y1.P$1 | Y1.P$1 56.95,27.18
  Top 0.406: C11.1 56.9,27.94 Y1.P$1
N$6
  Top 0.305: IC1.4 51.78,31.17 C9.2
  Top 0.61: C9.2 52.49,34.08 C15.A 50.46,34.16 L2.2
N$7  (via drill 0.3 pad 0.71)
  Top 0.254: IC1.55 IC1.54 55.25,20.19 69.72,20.19 74.93,25.4 74.93,25.91 75.69,26.67 76.96,26.67 77.47,27.18 77.47,31.11 78.11,31.75 v80.39,31.75 | v69.6,35.56 LED1.C
  Bottom 0.254: v80.39,31.75 80.39,33.91 78.74,35.56 v69.6,35.56
N$8
  Top 0.305: LED1.A 71.09,38.34 R9.1
N$9
  Top 0.305: Q1.1 58.86,35.24 59.69,36.07 59.69,37.05 R14.2
N$10
  Top 1.016: U$3.@22 U$3.22 U$3.#22
N$11
  Top 1.016: U$3.@15 U$3.15 U$3.#15
N$12
  Top 0.305: LED3.A 64.49,38.34 R13.2
N$13
  Top 1.016: U$3.#14 U$3.14 U$3.@14
N$14
  Top 1.016: U$3.@13 U$3.13 U$3.#13
N$15  (via drill 0.3)
  Top 0.254: IC1.18 40.46,24.71 37.85,22.1 v33.4,22.1
  Top 0.305: R10.2 v33.4,15.24
  Bottom 0.305: v33.4,22.1 v33.4,15.24
N$16
  Top 1.016: U$3.#5 U$3.5 U$3.@5
N$17
  Top 1.016: U$3.@6 U$3.6 U$3.#6
N$18
  Top 1.016: U$3.#7 U$3.7 U$3.@7
N$19
  Top 1.016: U$3.@8 U$3.8 U$3.#8
N$20
  Top 1.016: U$3.#9 U$3.9 U$3.@9
N$21
  Top 1.016: U$3.@10 U$3.10 U$3.#10
N$22
  Top 1.016: U$3.#11 U$3.11 U$3.@11
N$23
  Top 0.61: U$3.#4 SJ2.1
  Top 1.016: U$3.@4 U$3.4 U$3.#4
N$24
  Top 1.016: U$3.@12 U$3.12 U$3.#12
N$25
  Top 1.27: SV1.2 60.96,5.08 | 60.96,5.08 SV1.1 | D1.CATHODE 60.96,5.08
N$26  (via drill 3)
  other vias: 2.54,2.54
N$27  (via drill 3)
  other vias: 81.28,2.54
N$28  (via drill 3)
  other vias: 81.28,36.83
N$29  (via drill 3)
  other vias: 2.54,36.83
N$44
  Top 0.305: Q1.3 64.77,34.29 66.29,35.81 LED2.C
N$45
  Top 0.305: LED2.A 67.79,38.34 R2.2
N$50  (via drill 0.3)
  Top 0.254: v52.7,9.14 47.97,9.14 46.82,10.29 R1.2
  Bottom 0.254: v52.7,9.14 52.7,7.49 52.07,6.86 52.07,5.08 51.82,4.83 49.53,4.83 SV1.11
N$53
  Top 0.305: R11.2 40.22,6.52 SV1.17
N$54
  Top 0.305: R12.2 36.66,7.53 SV1.19

### Text on the board
tPlace: PWR | JTAG | UART | BC7 | AD4 | TX | BC6 | AD5 | BC5 | AD6 | EEPROM | BC2 | AC0 | RX | CS | CLK | DATA | DO | BC1 | AC2 | BC0 | AC3 | BD7 | AC4 | BD6 | AC5 | !FT RESET | BD5 | AC6 | BD4 | AC7 | BD3 | !PWREN | BD2 | !SSNPD
bPlace: !MCU_RST | JTAG_TDO | JTAG_TCK | JTAG_TMS | JTAG_TDI | JTAG_TRST | 3V3
bStop: MSB
tDocu: Reference Designs ARE PROVIDED "AS IS" AND "WITH ALL FAULTS. PARTICLE INDUSTRIES, INC / ("PARTICLE") DISCLAIMS ALL OTHER WARRANTIES, EXPRESS OR IMPLIED, REGARDING / PRODUCTS OR THE REFERENCE DESIGNS, INCLUDING BUT NOT LIMITED TO, ANY / IMPLIED WARRANTIES OF MERCHANTABILITY, FITNESS FOR A PARTICULAR PURPOSE, / OR NON-INFRINGEMENT. / / Particle may make changes to specifications and product descriptions at any / time, without notice. The Customer must not rely on the absence or / characteristics of any features or instructions marked "reserved" or / "undefined." Particle reserves these for future definition and shall have / no responsibility whatsoever for conflicts or incompatibilities arising / from future changes to them. The product information on the Web Site or / Materials is subject to change without notice. Do not finalize a design / with this information. / Particle is a registered trademark.